# EAGLE design volts_v01 (EAGLE 5.09)
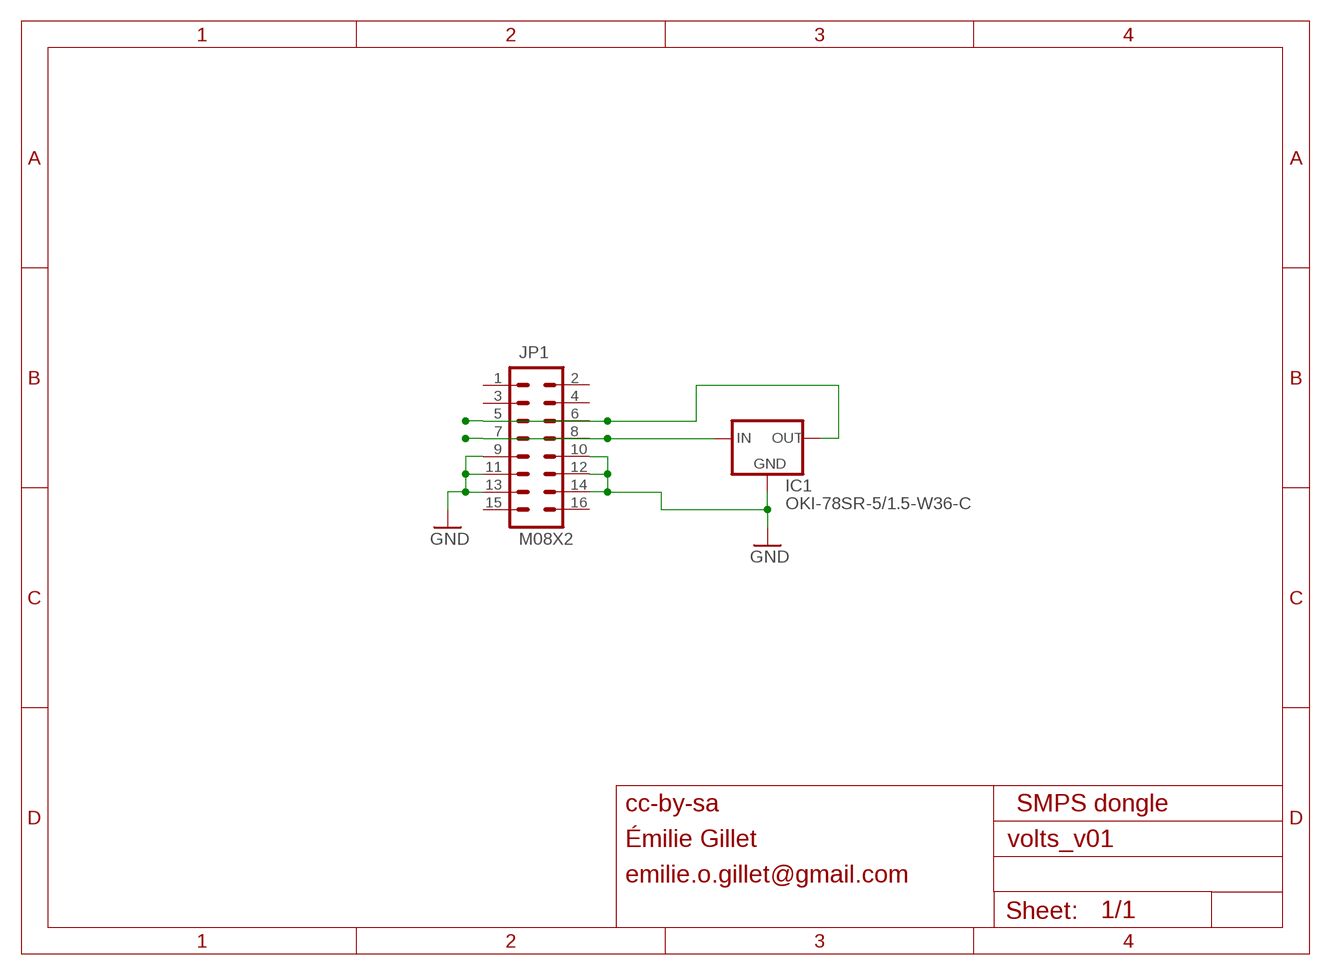
[diagram p0: schematic, sheet 1]

## Parts
IC1  OKI-78SR-5/1.5-W36-C  OKI-78SR  [OKI78SR]
JP1  M08X2  [2X8]

## Nets
GND: IC1.2(GND) JP1.9 JP1.10 JP1.11 JP1.12 JP1.13 JP1.14
N$1: IC1.1(IN) JP1.7 JP1.8
N$2: IC1.3(OUT) JP1.5 JP1.6
Unconnected: JP1.1 JP1.2 JP1.3 JP1.4 JP1.15 JP1.16

## Notes on the sheet
- cc-by-sa | SMPS dongle
- Émilie Gillet
- emilie.o.gillet@gmail.com

## Library data of the parts
IC1 = og-vreg:OKI-78SR
JP1 = SparkFun:M08X2

## Board
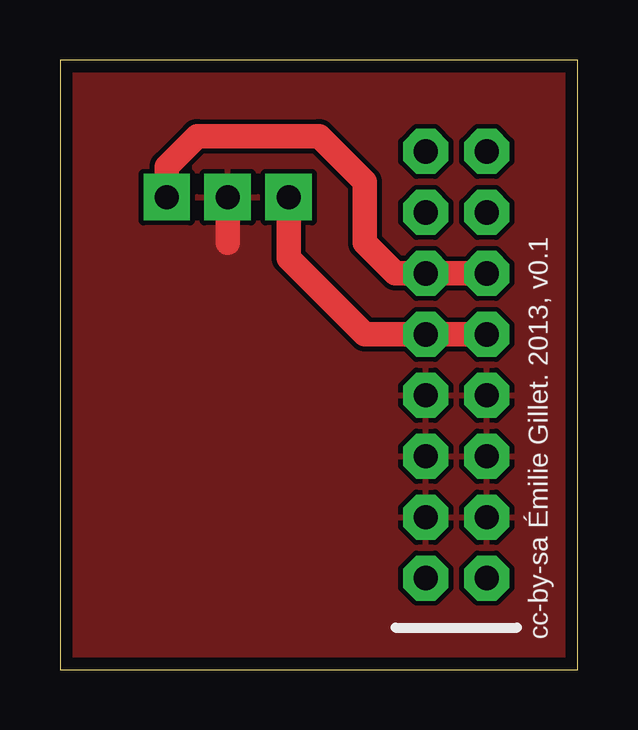
[diagram p1: board, top side]
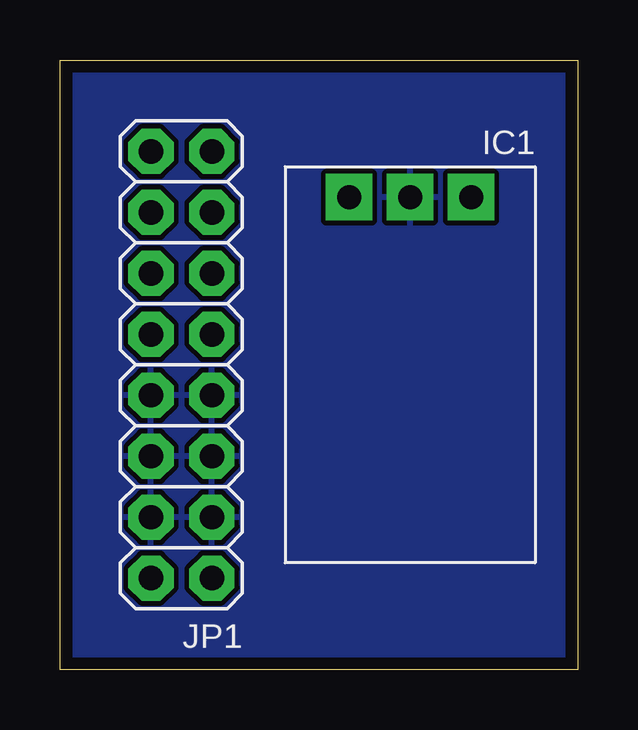
[diagram p2: board, bottom side, seen from below]

Size 21.57 x 25.4 mm. Coordinates in mm from the lower left corner, seen from the top.
Outline: 0,0 21.57,0 21.57,25.4 0,25.4 0,0
Copper layers (1*16): Top 0.035mm / dielectric 1.5mm / Bottom 0.035mm
Design rules "PCBCart-Standard *": minimum track width 8mil, minimum drill 0.4mm, track to track 8mil, track to pad 8mil, pad to pad 8mil, via to via 8mil, smd to smd 8mil, copper to edge 20mil, drill to drill 8mil, minimum pad ring 8mil, minimum via ring 10mil, stop-mask expansion 3mil, vias tented up to drill 0mil, thermal gap 8mil

### Footprints (pad centres in the part's own frame; a part is rotated, then mirrored left to right if it is on the bottom)
OKI78SR = drill 1 pad 1.93 square: 1 2.54,0; 2 0,0; 3 -2.54,0
2X8 = drill 1.016 pad 1.88 octagon: 1 0,0; 2 0,2.54; 3 2.54,0; 4 2.54,2.54; 5 5.08,0; 6 5.08,2.54; 7 7.62,0; 8 7.62,2.54; 9 10.16,0; 10 10.16,2.54; 11 12.7,0; 12 12.7,2.54; 13 15.24,0; 14 15.24,2.54; 15 17.78,0; 16 17.78,2.54

### Placement (x,y rotation side)
IC1  6.99,19.68 180 bottom
JP1  17.78,21.59 270 bottom
U$1  [LOGO_5VOLTS]  1.11,0.48 0 top
U$2  [LOGO_5VOLTS_EDIT]  1.91,11.43 0 top

### Tracks (layer width: path | path; a pad name or v marks a point on that pad's centre or on a via)
GND
  Top 1.016: IC1.2 6.99,17.78
  pour Top: 0,25.4 0,0 21.59,0 21.59,25.4
  pour Bottom: 0,25.4 0,0 21.59,0 21.59,25.4
N$1
  Top 1.016: IC1.1 9.53,17.14 12.7,13.97 JP1.8 JP1.7
N$2
  Top 1.016: IC1.3 4.45,20.95 5.71,22.23 10.79,22.23 12.7,20.32 12.7,17.78 13.97,16.51 JP1.6 JP1.5

### Text on the board
tNames: cc-by-sa Émilie Gillet. 2013, v0.1